# Altium schematic sheet Overview_Schematic.SchDoc: Bluetooth Gateway
size A3; CheckedBy: QUOCTHANG; DrawnBy: DONGKHOA; Revision: V1.0.0; SheetNumber: 1; SheetTotal: 10
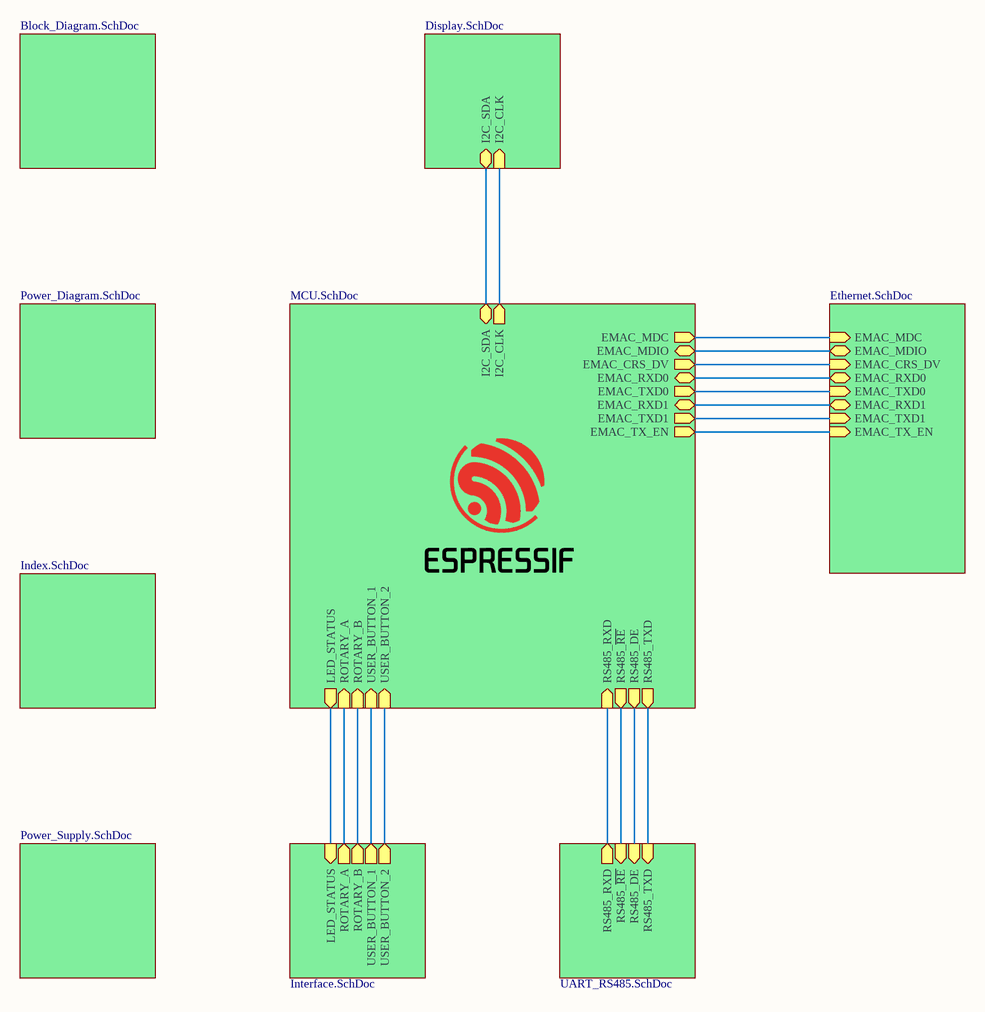
[diagram p0: Overview_Schematic.SchDoc]

## Sub-sheets
Designator = Block_Diagram.SchDoc: no entries
Designator = Power_Diagram.SchDoc: no entries
Designator = MCU.SchDoc: EMAC_MDC (out), EMAC_MDIO (bidir), EMAC_CRS_DV (out), EMAC_RXD0 (bidir), EMAC_RXD1 (bidir), EMAC_TXD0 (out), EMAC_TXD1 (out), EMAC_TX_EN (out), I2C_SDA (bidir), I2C_CLK (out), LED_STATUS (out), ROTARY_A (in), ROTARY_B (in), USER_BUTTON_1 (in), USER_BUTTON_2 (in), RS485_RXD (in), RS485_~{RE} (out), RS485_DE (out), RS485_TXD (out)
Designator = Ethernet.SchDoc: EMAC_MDC (in), EMAC_MDIO (bidir), EMAC_CRS_DV (in), EMAC_RXD0 (bidir), EMAC_RXD1 (bidir), EMAC_TXD0 (in), EMAC_TXD1 (in), EMAC_TX_EN (in)
Designator = UART_RS485.SchDoc: RS485_RXD (out), RS485_~{RE} (in), RS485_DE (in), RS485_TXD (in)
Designator = Index.SchDoc: no entries
Designator = Power_Supply.SchDoc: no entries
Designator = Display.SchDoc: I2C_SDA (bidir), I2C_CLK (in)
Designator = Interface.SchDoc: LED_STATUS (in), ROTARY_A (out), ROTARY_B (out), USER_BUTTON_1 (out), USER_BUTTON_2 (out)

## Nets
(unnamed): sheet Designator/EMAC_MDC, sheet Designator/EMAC_MDC
(unnamed): sheet Designator/EMAC_MDIO, sheet Designator/EMAC_MDIO
(unnamed): sheet Designator/EMAC_CRS_DV, sheet Designator/EMAC_CRS_DV
(unnamed): sheet Designator/EMAC_RXD0, sheet Designator/EMAC_RXD0
(unnamed): sheet Designator/EMAC_RXD1, sheet Designator/EMAC_RXD1
(unnamed): sheet Designator/EMAC_TXD0, sheet Designator/EMAC_TXD0
(unnamed): sheet Designator/EMAC_TXD1, sheet Designator/EMAC_TXD1
(unnamed): sheet Designator/EMAC_TX_EN, sheet Designator/EMAC_TX_EN
(unnamed): sheet Designator/I2C_SDA, sheet Designator/I2C_SDA
(unnamed): sheet Designator/I2C_CLK, sheet Designator/I2C_CLK
(unnamed): sheet Designator/LED_STATUS, sheet Designator/LED_STATUS
(unnamed): sheet Designator/ROTARY_A, sheet Designator/ROTARY_A
(unnamed): sheet Designator/ROTARY_B, sheet Designator/ROTARY_B
(unnamed): sheet Designator/USER_BUTTON_1, sheet Designator/USER_BUTTON_1
(unnamed): sheet Designator/USER_BUTTON_2, sheet Designator/USER_BUTTON_2
(unnamed): sheet Designator/RS485_RXD, sheet Designator/RS485_RXD
(unnamed): sheet Designator/RS485_~{RE}, sheet Designator/RS485_~{RE}
(unnamed): sheet Designator/RS485_DE, sheet Designator/RS485_DE
(unnamed): sheet Designator/RS485_TXD, sheet Designator/RS485_TXD

## Notes on the sheet
- Project Name
- Size
- A3
- Revision
- Checked By:
- Drawn By:
- Date:
- File:
- Last Modified:
- Sheet
- of